# EAGLE design untitled (EAGLE 8.3.2)
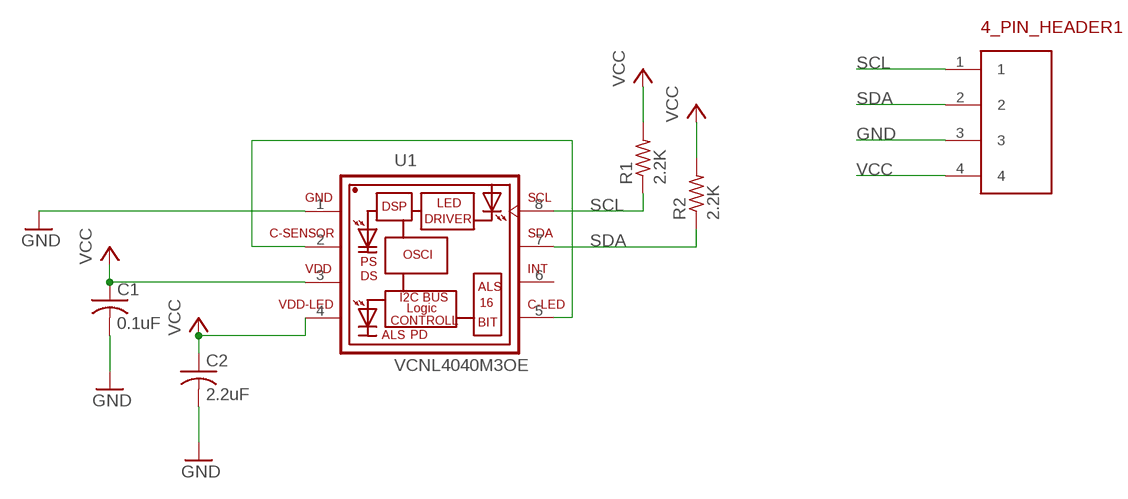
[diagram p0: schematic, sheet 1]

## Parts
4_PIN_HEADER1  4_PIN_HEADER  [4_PIN_HEADER]
C1  0.1uF  C_0201  [C0201]
C2  2.2uF  C_0201  [C0201]
R1  2.2K  R_0201  [R0201]
R2  2.2K  R_0201  [R0201]
U1  VCNL4040M3OE  [VISHAY_VCNL4040_4X2X1.1]

## Nets
GND: 4_PIN_HEADER1.3 C1.2 C2.2 U1.1(GND)
N$4: U1.2(C-SENSOR) U1.5(C-LED)
SCL: 4_PIN_HEADER1.1 R1.1 U1.8(SCL)
SDA: 4_PIN_HEADER1.2 R2.1 U1.7(SDA)
VCC: 4_PIN_HEADER1.4 C1.1 C2.1 R1.2 R2.2 U1.3(VDD) U1.4(VDD-LED)
Unconnected: U1.6(INT)

## Library data of the parts
4_PIN_HEADER1 = custom:4_PIN_HEADER
C1 C2 = custom:C_0201
R1 R2 = custom:R_0201
U1 = VCNL4040M3OE:VCNL4040M3OE: VCNL4040 Fully Integrated Proximity and Ambient Light Sensor with Infrared Emitter, I2C Interface, and Interrupt Function: VCNL4040 integrates a proximity sensor (PS), ambient light sensor (ALS), and a high power IRED into one small package. It incorporates photodiodes, amplifiers, and analog to digital converting circuits into a single chip by CMOS process. The 16-bit high resolution ALS offers excellent sensing capabilities with sufficient selections to fulfill most applications whether dark or high transparency lens design. High and low interrupt thresholds can be programmed for both ALS and PS, allowing the component to use a minimal amount of the microcontrollers resources. Device Model created 15.06.2016 by Johannes Kolb - Vishay Semiconductor GmbH; AVAILABILITY: Good; DESCRIPTION: VCNL4040 Series 3.6 V 200 mm 16 Bit I2C SMT Proximity and Ambient Light Sensor; MF: Vishay; MP: VCNL4040M3OE; PACKAGE: SMD-8 Vishay; PRICE: 1.34 USD

## Board
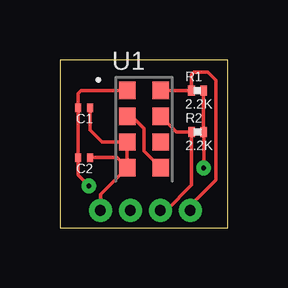
[diagram p1: board, top side]
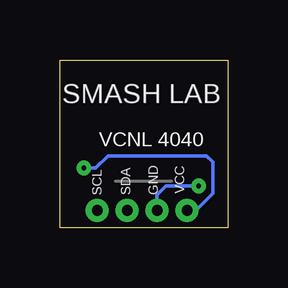
[diagram p2: board, bottom side, seen from below]

Size 7 x 7 mm. Coordinates in mm from the lower left corner, seen from the top.
Outline: 0,0 7,0 7,7 0,7 0,0
Copper layers (1*16): Top 0.035mm / dielectric 1.5mm / Bottom 0.035mm
Design rules "default": minimum track width 6mil, minimum drill 0.35mm, track to track 6mil, track to pad 6mil, pad to pad 6mil, via to via 6mil, smd to smd 6mil, copper to edge 40mil, drill to drill 6mil, minimum pad ring 10mil, minimum via ring 8mil, stop-mask expansion 4mil, vias tented up to drill 0mil, thermal gap 10mil

### Footprints (pad centres in the part's own frame; a part is rotated, then mirrored left to right if it is on the bottom)
4_PIN_HEADER = drill 0.45: 1 0.5,4.25; 2 0.5,3; 3 0.5,1.75; 4 0.5,0.5
C0201 = smd 0.25 x 0.35: 1 -0.25,0; 2 0.25,0
R0201 = smd 0.28 x 0.43: 1 -0.255,0; 2 0.255,0
VISHAY_VCNL4040_4X2X1.1 = smd 0.7 x 0.725: 1 -0.7,1.613; 2 -0.7,0.537; 3 -0.7,-0.537; 4 -0.7,-1.613; 5 0.7,-1.613; 6 0.7,-0.537; 7 0.7,0.537; 8 0.7,1.613

### Placement (x,y rotation side)
4_PIN_HEADER1  1.19,1.22 270 top
C1  1,5 180 top
C2  1.01,2.92 180 top
R1  5.74,5.72 0 top
R2  5.75,3.99 0 top
U1  3.51,4.11 0 top

### Tracks (layer width: path | path; a pad name or v marks a point on that pad's centre or on a via)
GND  (via drill 0.2)
  Top 0.152: C1.2 | C1.2 0.75,5.59 0.88,5.72 U1.1 | C1.2 C2.2 0.76,2.19 v1.21,1.74
  Bottom 0.152: v1.21,1.74 2.57,1.74 2.94,1.37 2.94,1.09 4_PIN_HEADER1.3
N$4
  Top 0.152: U1.2 2.98,4.65 3.5,4.13 3.5,3.21 U1.5
SCL
  Top 0.152: U1.8 R1.1 5.48,6.38 5.59,6.49 6.18,6.49 6.51,6.16 6.51,2 5.44,0.93 4_PIN_HEADER1.1
SDA
  Top 0.152: U1.7 4.87,3.99 R2.1 5.5,1.78 4.44,0.72 4_PIN_HEADER1.2
VCC  (via drill 0.2)
  Top 0.152: C1.1 1.25,4.08 1.76,3.57 U1.3 U1.4 | 4_PIN_HEADER1.4 1.69,1.38 U1.4 | R1.2 R2.2 v6,2.5 v6,2.49 | C2.1 2.38,2.92 U1.4
  Bottom 0.152: v6,2.49 5.51,2.49 5,3 0.89,3 0.62,2.73 0.62,1.42 1.32,0.72 4_PIN_HEADER1.4

### Text on the board
bNames: SMASH LAB | VCNL 4040 | VCC | GND | SDA | SCL